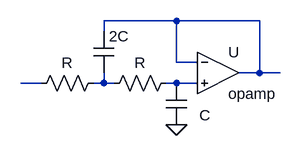
[diagram p0: schematic ActiveLPF.asc]
ActiveLPF.asc, the LTspice schematic file:
Version 4
SHEET 1 880 680
WIRE 160 80 48 80
WIRE 288 80 160 80
WIRE 48 96 48 80
WIRE 160 144 160 80
WIRE 192 144 160 144
WIRE 288 160 288 80
WIRE 288 160 256 160
WIRE 320 160 288 160
WIRE -48 176 -80 176
WIRE 48 176 48 160
WIRE 48 176 32 176
WIRE 64 176 48 176
WIRE 160 176 144 176
WIRE 192 176 160 176
FLAG 160 240 0
SYMBOL Opamps\\opamp 224 96 R0
SYMATTR InstName U
SYMBOL cap 144 176 R0
WINDOW 0 51 49 Left 2
SYMATTR InstName C
SYMATTR Value ""
SYMBOL res 160 160 R90
WINDOW 0 0 56 VBottom 2
WINDOW 3 32 56 VTop 2
SYMATTR InstName R
SYMATTR Value ""
SYMBOL res 48 160 R90
WINDOW 0 0 56 VBottom 2
WINDOW 3 32 56 VTop 2
SYMATTR InstName R
SYMATTR Value ""
SYMBOL cap 32 96 R0
SYMATTR InstName 2C
SYMATTR Value ""

The netlist it stands for:
* ActiveLPF.asc
XU N001 N004 N001 opamp Aol=100K GBW=10Meg  ; pins invin noninvin out
C N004 0
R N004 N003
R N003 N002
C§2C N001 N003
.backanno
.end